# EAGLE design 3_Phase_Controller_V0.3 (EAGLE 9.6.2)
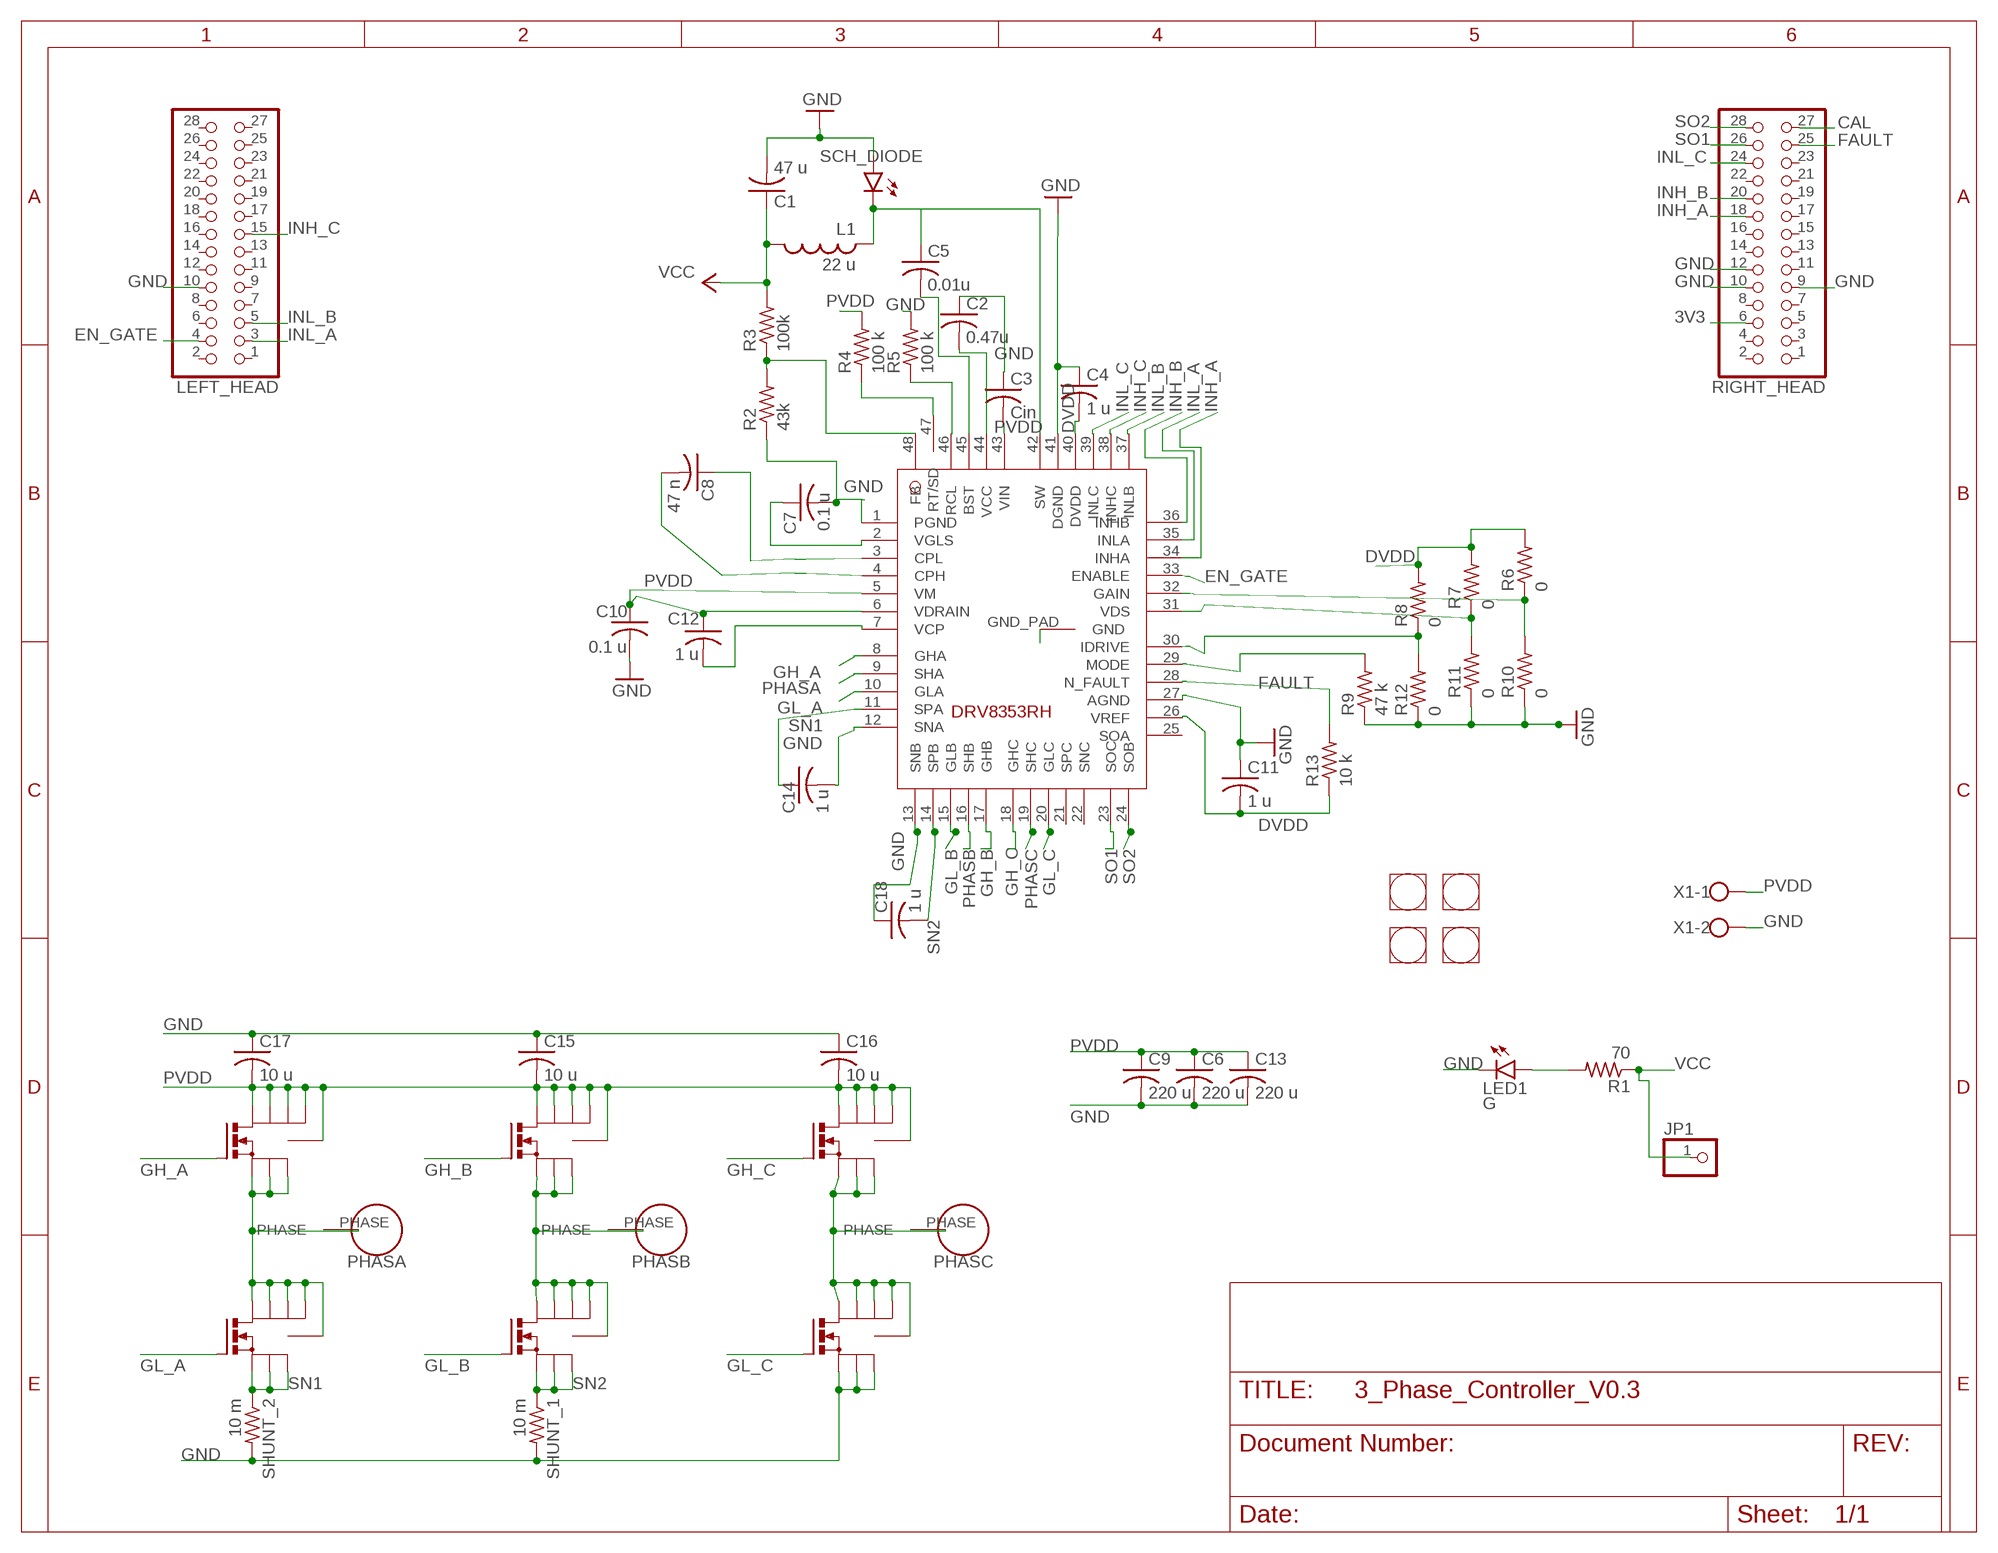
[diagram p0: schematic, sheet 1]

## Parts
A_H  SIR178DP  [POWERPAK_SO-8_SINGLE]
A_L  SIR178DP  [POWERPAK_SO-8_SINGLE]
B_H  SIR178DP  [POWERPAK_SO-8_SINGLE]
B_L  SIR178DP  [POWERPAK_SO-8_SINGLE]
C1  47 u  C-US025-024X044  [C025-024X044]
C2  0.47u  C-USC0805  [C0805]
C3  Cin  C-USC0805  [C0805]
C4  1 u  C-USC0805  [C0805]
C5  0.01u  C-USC0805  [C0805]
C6  220 u  C-US050-045X075  [C050-045X075]
C7  0.1 u  C-USC0805  [C0805]
C8  47 n  C-USC0805  [C0805]
C9  220 u  C-US050-045X075  [C050-045X075]
C10  0.1 u  C-USC0805  [C0805]
C11  1 u  C-USC0805  [C0805]
C12  1 u  C-USC0805  [C0805]
C13  220 u  C-US050-045X075  [C050-045X075]
C14  1 u  C-USC0805  [C0805]
C15  10 u  C-USC1206  [C1206]
C16  10 u  C-USC1206  [C1206]
C17  10 u  C-USC1206  [C1206]
C18  1 u  C-USC0805  [C0805]
C_H  SIR178DP  [POWERPAK_SO-8_SINGLE]
C_L  SIR178DP  [POWERPAK_SO-8_SINGLE]
JP1  PINHD-1X1  [1X01]
L1  22 u  L-USL3225M  [L3225M]
LED1  G  LEDSML0805  [SML0805]
LEFT_HEAD  PINHD-2X14  [2X14]
PHASE_A  PHASE_HOLE_V_0.2  [HOLE_V_0.2]
PHASE_B  PHASE_HOLE_V_0.2  [HOLE_V_0.2]
PHASE_C  PHASE_HOLE_V_0.2  [HOLE_V_0.2]
R1  70  R-US_R0805  [R0805]
R2  43k  R-US_R0603  [R0603]
R3  100k  R-US_R0603  [R0603]
R4  100 k  R-US_R0805  [R0805]
R5  100 k  R-US_R0805  [R0805]
R6  0  R-US_R0603  [R0603]
R7  0  R-US_R0603  [R0603]
R8  0  R-US_R0603  [R0603]
R9  47 k  R-US_R0603  [R0603]
R10  0  R-US_R0603  [R0603]
R11  0  R-US_R0603  [R0603]
R12  0  R-US_R0603  [R0603]
R13  10 k  R-US_R0603  [R0603]
RIGHT_HEAD  PINHD-2X14  [2X14]
SCH_DIODE  LEDCHIP-LED0805  [CHIP-LED0805]
SHUNT_1  10 m  R-US_R2512  [R2512]
SHUNT_2  10 m  R-US_R2512  [R2512]
U$1  STANDOFF  [STANDOFF]
U$2  STANDOFF  [STANDOFF]
U$3  DRV8353RH  [VQFN-RGZ0048A]
U$4  STANDOFF  [STANDOFF]
U$5  STANDOFF  [STANDOFF]
X1  W237-102  [W237-102]

## Nets
3V3: RIGHT_HEAD.6
CAL: RIGHT_HEAD.27
DVDD: C4.2 C11.2 R6.2 R7.2 R8.2 R13.1 U$3.26(VREF) U$3.40(DVDD)
EN_GATE: LEFT_HEAD.4 U$3.33(ENABLE)
FAULT: R13.2 RIGHT_HEAD.25 U$3.28(N_FAULT)
GH_A: A_H.GATE(G) U$3.8(GHA)
GH_B: B_H.GATE(G) U$3.17(GHB)
GH_C: C_H.GATE(G) U$3.18(GHC)
GL_A: A_L.GATE(G) U$3.10(GLA)
GL_B: B_L.GATE(G) U$3.15(GLB)
GL_C: C_L.GATE(G) U$3.20(GLC)
GND: C1.2 C2.1 C3.1 C4.1 C6.2 C7.2 C9.2 C10.2 C11.1 C13.2 C14.2 C15.1 C16.1 C17.1 C18.1 C_L.S_1(S) C_L.S_2(S1) C_L.S_3(S2) LED1.C LEFT_HEAD.10 R2.1 R5.2 R9.1 R10.1 R11.1 R12.1 RIGHT_HEAD.9 RIGHT_HEAD.10 RIGHT_HEAD.12 SCH_DIODE.A SHUNT_1.2 SHUNT_2.2 U$3.1(PGND) U$3.12(SNA) U$3.13(SNB) U$3.27(AGND) U$3.41(DGND) U$3.GND_PAD(GND) X1.2
INH_A: RIGHT_HEAD.18 U$3.34(INHA)
INH_B: RIGHT_HEAD.20 U$3.36(INHB)
INH_C: LEFT_HEAD.15 U$3.38(INHC)
INL_A: LEFT_HEAD.3 U$3.35(INLA)
INL_B: LEFT_HEAD.5 U$3.37(INLB)
INL_C: RIGHT_HEAD.24 U$3.39(INLC)
N$1: LED1.A R1.2
N$2: R6.1 R10.2 U$3.32(GAIN)
N$4: R2.2 R3.1 U$3.48(FB)
N$5: R7.1 R11.2 U$3.31(VDS)
N$6: C5.2 U$3.45(BST)
N$7: R8.1 R12.2 U$3.30(IDRIVE)
N$8: R9.2 U$3.29(MODE)
N$9: C2.2 U$3.44(VCC)
N$12: C12.2 U$3.7(VCP)
N$13: C7.1 U$3.2(VGLS)
N$14: R5.1 U$3.46(RCL)
N$15: R4.1 U$3.47(RT/SD)
N$21: C5.1 L1.2 SCH_DIODE.C U$3.42(SW)
N$22: C8.2 U$3.4(CPH)
N$23: C8.1 U$3.3(CPL)
PHASA: A_H.S_1(S) A_H.S_2(S1) A_H.S_3(S2) A_L.D_1(D) A_L.D_2(D1) A_L.D_3(D2) A_L.D_4(D3) A_L.THRM(THERMAL) PHASE_A.PHASE U$3.9(SHA)
PHASB: B_H.S_1(S) B_H.S_2(S1) B_H.S_3(S2) B_L.D_1(D) B_L.D_2(D1) B_L.D_3(D2) B_L.D_4(D3) B_L.THRM(THERMAL) PHASE_B.PHASE U$3.16(SHB)
PHASC: C_H.S_1(S) C_H.S_2(S1) C_H.S_3(S2) C_L.D_1(D) C_L.D_2(D1) C_L.D_3(D2) C_L.D_4(D3) C_L.THRM(THERMAL) PHASE_C.PHASE U$3.19(SHC)
PVDD: A_H.D_1(D) A_H.D_2(D1) A_H.D_3(D2) A_H.D_4(D3) A_H.THRM(THERMAL) B_H.D_1(D) B_H.D_2(D1) B_H.D_3(D2) B_H.D_4(D3) B_H.THRM(THERMAL) C3.2 C6.1 C9.1 C10.1 C12.1 C13.1 C15.2 C16.2 C17.2 C_H.D_1(D) C_H.D_2(D1) C_H.D_3(D2) C_H.D_4(D3) C_H.THRM(THERMAL) R4.2 U$3.5(VM) U$3.6(VDRAIN) U$3.43(VIN) X1.1
SN1: A_L.S_1(S) A_L.S_2(S1) A_L.S_3(S2) C14.1 SHUNT_2.1 U$3.11(SPA)
SN2: B_L.S_1(S) B_L.S_2(S1) B_L.S_3(S2) C18.2 SHUNT_1.1 U$3.14(SPB)
SO1: RIGHT_HEAD.26 U$3.23(SOC)
SO2: RIGHT_HEAD.28 U$3.24(SOB)
VCC: C1.1 JP1.1 L1.1 R1.1 R3.2
Unconnected: LEFT_HEAD.1 LEFT_HEAD.2 LEFT_HEAD.6 LEFT_HEAD.7 LEFT_HEAD.8 LEFT_HEAD.9 LEFT_HEAD.11 LEFT_HEAD.12 LEFT_HEAD.13 LEFT_HEAD.14 LEFT_HEAD.16 LEFT_HEAD.17 LEFT_HEAD.18 LEFT_HEAD.19 LEFT_HEAD.20 LEFT_HEAD.21 LEFT_HEAD.22 LEFT_HEAD.23 LEFT_HEAD.24 LEFT_HEAD.25 LEFT_HEAD.26 LEFT_HEAD.27 LEFT_HEAD.28 RIGHT_HEAD.1 RIGHT_HEAD.2 RIGHT_HEAD.3 RIGHT_HEAD.4 RIGHT_HEAD.5 RIGHT_HEAD.7 RIGHT_HEAD.8 RIGHT_HEAD.11 RIGHT_HEAD.13 RIGHT_HEAD.14 RIGHT_HEAD.15 RIGHT_HEAD.16 RIGHT_HEAD.17 RIGHT_HEAD.19 RIGHT_HEAD.21 RIGHT_HEAD.22 RIGHT_HEAD.23 U$3.21(SPC) U$3.22(SNC) U$3.25(SOA)

## Library data of the parts
A_H A_L B_H B_L C_H C_L = Brad_Library:SIR178DP
C1-C5 C7 C8 C10-C12 C14-C18 = rcl:C-US: CAPACITOR, American symbol; SPICEPREFIX: C
C6 C9 C13 = Brad_Library:C-US: CAPACITOR, American symbol; SPICEPREFIX: C
JP1 = pinhead:PINHD-1X1: PIN HEADER
L1 = rcl:L-US: INDUCTOR, American symbol; SPICEPREFIX: L
LED1 SCH_DIODE = led:LED: LED OSRAM: - CHIPLED LG R971, LG N971, LY N971, LG Q971, LY Q971, LO R971, LY R971 LH N974, LH R974 LS Q976, LO Q976, LY Q976 LO Q996 - Hyper CHIPLED LW Q18S LB Q993, LB Q99A, LB R99A - SideLED LS A670, LO A670, LY A670, LG A670, LP A670 LB A673, LV A673, LT A673, LW A673 LH A674 LY A675 LS A676, LA A676, LO A676, LY A676, LW A676 LS A679, LY A679, LG A679 - Hyper Micro SIDELED® LS Y876, LA Y876, LO Y876, LY Y876 LT Y87S - SmartLED LW L88C, LW L88S LB L89C, LB L89S, LG L890 LS L89K, LO L89K, LY L89K LS L896, LA L896, LO L896, LY L896 - TOPLED LS T670, LO T670, LY T670, LG T670, LP T670 LSG T670, LSP T670, LSY T670, LOP T670, LYG T670 LG T671, LOG T671, LSG T671 LB T673, LV T673, LT T673, LW T673 LH T674 LS T676, LA T676, LO T676, LY T676, LB T676, LH T676, LSB T676, LW T676 LB T67C, LV T67C, LT T67C, LS T67K, LO T67K, LY T67K, LW E67C LS E67B, LA E67B, LO E67B, LY E67B, LB E67C, LV E67C, LT E67C LW T67C LS T679, LY T679, LG T679 LS T770, LO T770, LY T770, LG T770, LP T770 LB T773, LV T773, LT T773, LW T773 LH T774 LS E675, LA E675, LY E675, LS T675 LS T776, LA T776, LO T776, LY T776, LB T776 LHGB T686 LT T68C, LB T68C - Hyper Mini TOPLED® LB M676 - Mini TOPLED Santana® LG M470 LS M47K, LO M47K, LY M47K Source: http://www.osram.convergy.de LUXEON: - LUMILED® LXK2-PW12-R00, LXK2-PW12-S00, LXK2-PW14-U00, LXK2-PW14-V00 LXK2-PM12-R00, LXK2-PM12-S00, LXK2-PM14-U00 LXK2-PE12-Q00, LXK2-PE12-R00, LXK2-PE12-S00, LXK2-PE14-T00, LXK2-PE14-U00 LXK2-PB12-K00, LXK2-PB12-L00, LXK2-PB12-M00, LXK2-PB14-N00, LXK2-PB14-P00, LXK2-PB14-Q00 LXK2-PR12-L00, LXK2-PR12-M00, LXK2-PR14-Q00, LXK2-PR14-R00 LXK2-PD12-Q00, LXK2-PD12-R00, LXK2-PD12-S00 LXK2-PH12-R00, LXK2-PH12-S00 LXK2-PL12-P00, LXK2-PL12-Q00, LXK2-PL12-R00 Source: www.luxeon.com KINGBRIGHT: KA-3528ASYC Source: www.kingbright.com
LEFT_HEAD RIGHT_HEAD = Brad_Library:PINHD-2X14: PIN HEADER
PHASE_A PHASE_B PHASE_C = Brad_Library:PHASE_HOLE_V_0.2
R1-R13 = rcl:R-US_: RESISTOR, American symbol; SPICEPREFIX: R
SHUNT_1 SHUNT_2 = Brad_Library:R-US_: RESISTOR, American symbol; SPICEPREFIX: R
U$1 U$2 U$4 U$5 = Brad_Library:STANDOFF
U$3 = Brad_Library:DRV8353RH
X1 = Brad_Library:W237-102: WAGO SCREW CLAMP; MPN: 237-102; OC_FARNELL: unknown; OC_NEWARK: 70K9898

## Board
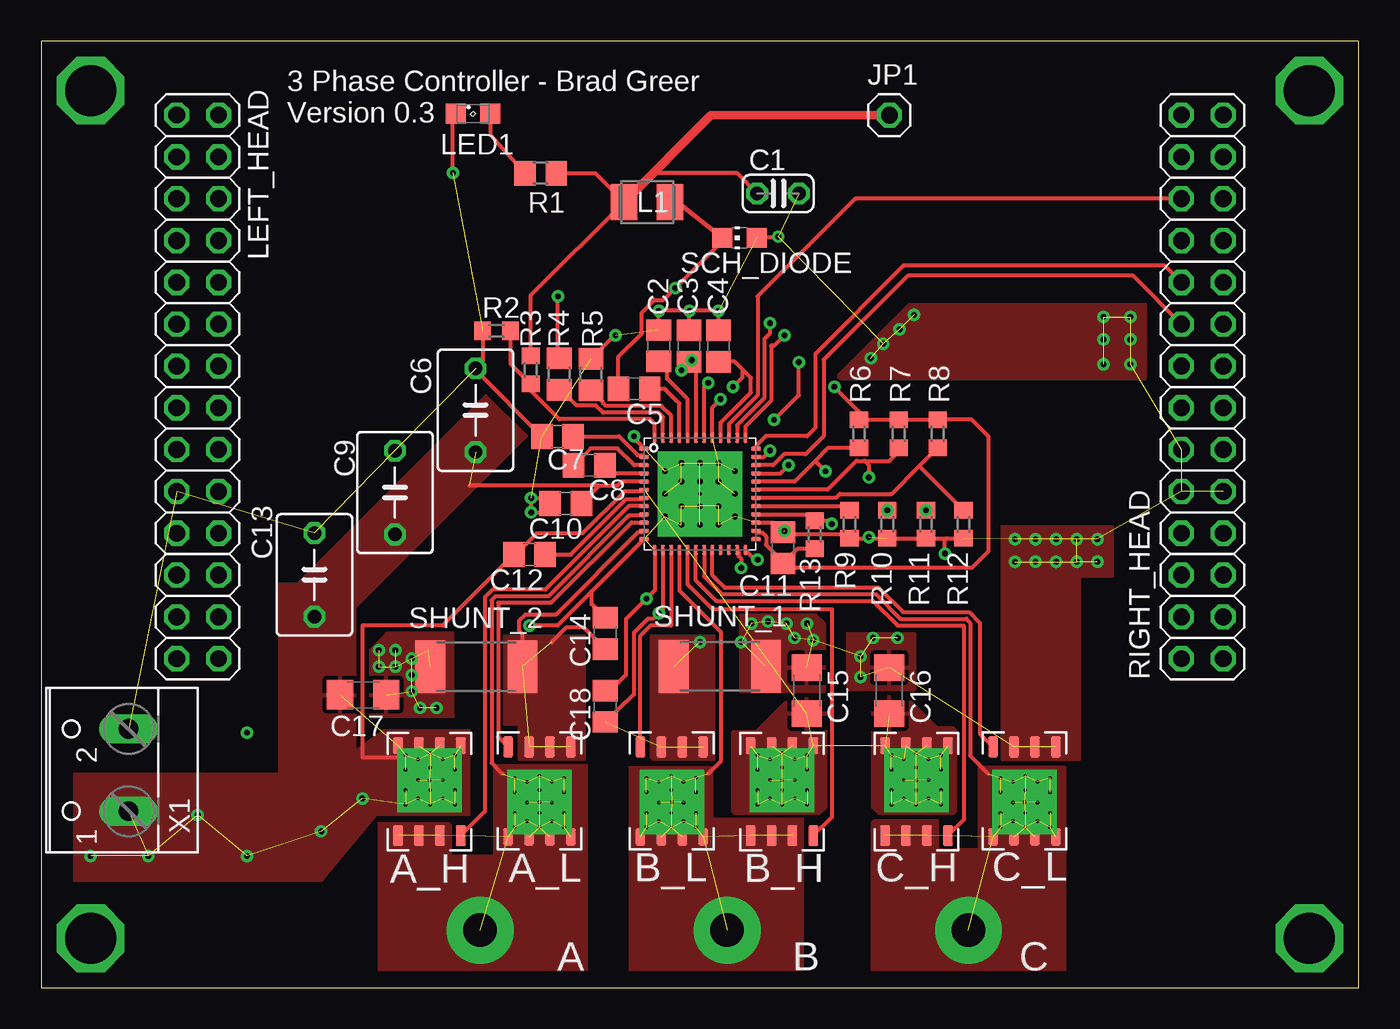
[diagram p1: board, top side]
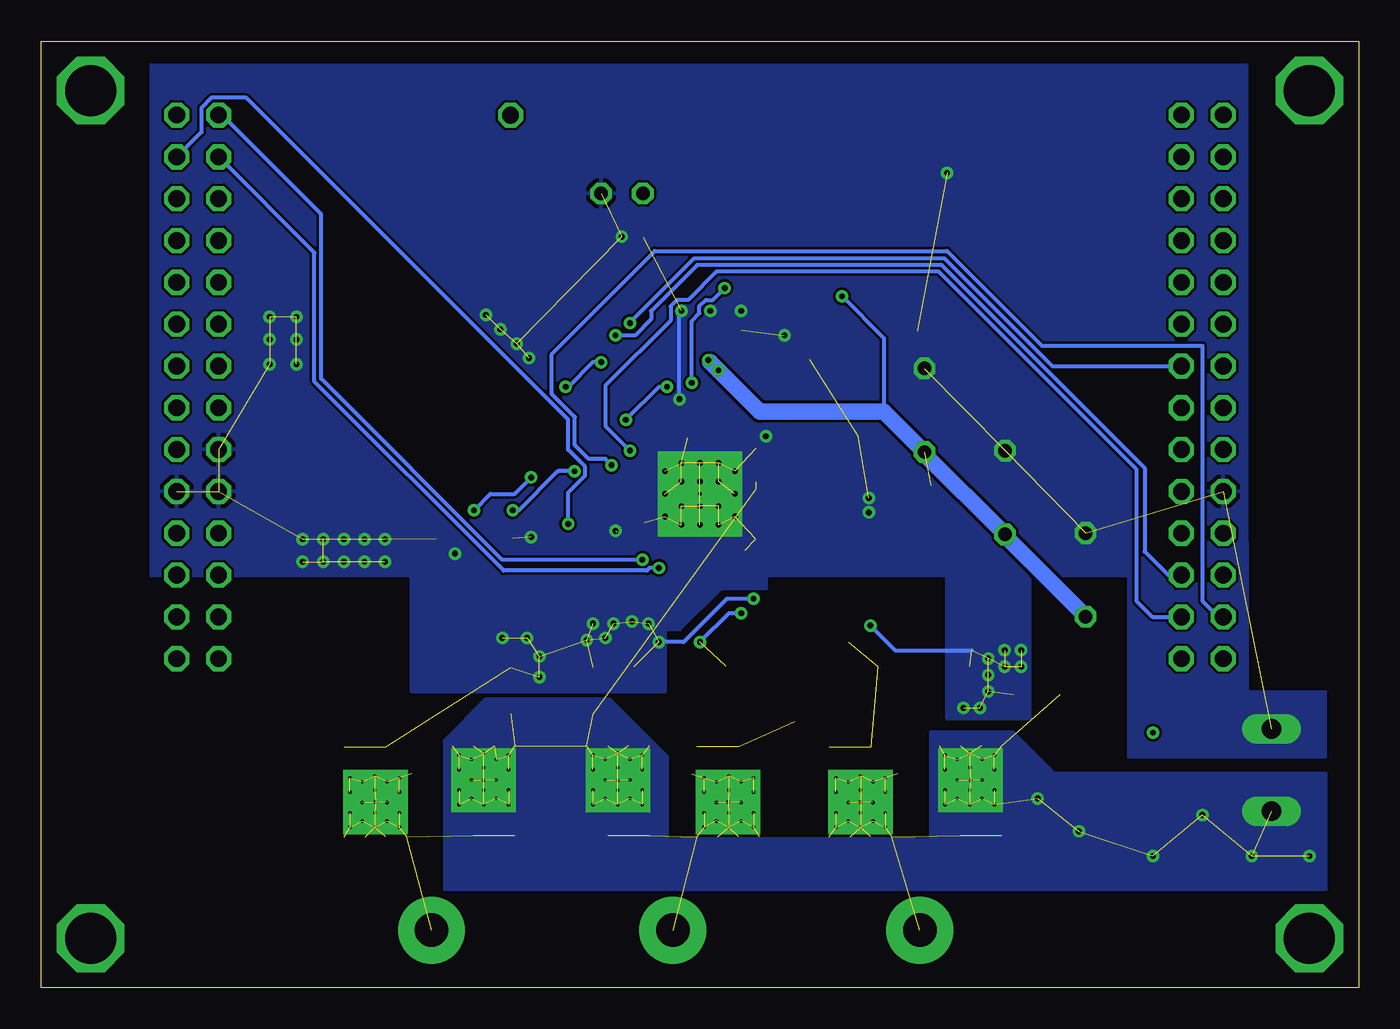
[diagram p2: board, bottom side, seen from below]

Size 80 x 57.5 mm. Coordinates in mm from the lower left corner, seen from the top.
Outline: 0,0 80,0 80,57.5 0,57.5 0,0
Copper layers (1*16): Top 0.035mm / dielectric 1.5mm / Bottom 0.035mm
Design rules "default": minimum track width 6mil, minimum drill 0.35mm, track to track 6mil, track to pad 6mil, pad to pad 6mil, via to via 6mil, smd to smd 6mil, copper to edge 40mil, drill to drill 6mil, minimum pad ring 10mil, minimum via ring 8mil, stop-mask expansion 4mil, vias tented up to drill 0mil, thermal gap 10mil

### Footprints (pad centres in the part's own frame; a part is rotated, then mirrored left to right if it is on the bottom)
POWERPAK_SO-8_SINGLE = smd 1.016 x 0.61: D_1 6.096,-1.905; D_2 6.096,-0.635; D_3 6.096,0.635; D_4 6.096,1.905 | smd 1.27 x 0.61: GATE 0.635,-1.905; S_1 0.635,1.905; S_2 0.635,0.635; S_3 0.635,-0.635 | drill 0.203 pad 3.912 square: THRM 3.988,0
C025-024X044 = drill 0.813 octagon: 1 -1.27,0; 2 1.27,0
C0805 = smd 1.3 x 1.5: 1 -0.95,0; 2 0.95,0
C050-045X075 = drill 0.813 octagon: 1 -2.54,0; 2 2.54,0
C1206 = smd 1.6 x 1.8: 1 -1.4,0; 2 1.4,0
1X01 = drill 1.016 octagon: 1 0,0
L3225M = smd 1.6 x 2.2: 1 -1.4,0; 2 1.4,0
SML0805 = smd 1.2 x 1.2: A 1.05,0; C -1.05,0
2X14 = drill 1.016 octagon: 1 -16.51,-1.27; 2 -16.51,1.27; 3 -13.97,-1.27; 4 -13.97,1.27; 5 -11.43,-1.27; 6 -11.43,1.27; 7 -8.89,-1.27; 8 -8.89,1.27; 9 -6.35,-1.27; 10 -6.35,1.27; 11 -3.81,-1.27; 12 -3.81,1.27; 13 -1.27,-1.27; 14 -1.27,1.27; 15 1.27,-1.27; 16 1.27,1.27; 17 3.81,-1.27; 18 3.81,1.27; 19 6.35,-1.27; 20 6.35,1.27; 21 8.89,-1.27; 22 8.89,1.27; 23 11.43,-1.27; 24 11.43,1.27; 25 13.97,-1.27; 26 13.97,1.27; 27 16.51,-1.27; 28 16.51,1.27
HOLE_V_0.2 = drill 2.032 pad 4.064: PHASE 0,0
R0805 = smd 1.3 x 1.5: 1 -0.95,0; 2 0.95,0
R0603 = smd 1 x 1.1: 1 -0.85,0; 2 0.85,0
CHIP-LED0805 = smd 1.2 x 1.2: A 0,-1.05; C 0,1.05
R2512 = smd 1.8 x 3.2: 1 -2.8,0; 2 2.8,0
STANDOFF = drill 3.1 octagon: P$1 0,0
VQFN-RGZ0048A = smd 0.6 x 0.24: 1 -3.4,2.75; 2 -3.4,2.25; 3 -3.4,1.75; 4 -3.4,1.25; 5 -3.4,0.75; 6 -3.4,0.25; 7 -3.4,-0.25; 8 -3.4,-0.75; 9 -3.4,-1.25; 10 -3.4,-1.75; 11 -3.4,-2.25; 12 -3.4,-2.75; 25 3.4,-2.75; 26 3.4,-2.25; 27 3.4,-1.75; 28 3.4,-1.25; 29 3.4,-0.75; 30 3.4,-0.25; 31 3.4,0.25; 32 3.4,0.75; 33 3.4,1.25; 34 3.4,1.75; 35 3.4,2.25; 36 3.4,2.75 | smd 0.24 x 0.6: 13 -2.75,-3.4; 14 -2.25,-3.4; 15 -1.75,-3.4; 16 -1.25,-3.4; 17 -0.75,-3.4; 18 -0.25,-3.4; 19 0.25,-3.4; 20 0.75,-3.4; 21 1.25,-3.4; 22 1.75,-3.4; 23 2.25,-3.4; 24 2.75,-3.4; 37 2.75,3.4; 38 2.25,3.4; 39 1.75,3.4; 40 1.25,3.4; 41 0.75,3.4; 42 0.25,3.4; 43 -0.25,3.4; 44 -0.75,3.4; 45 -1.25,3.4; 46 -1.75,3.4; 47 -2.25,3.4; 48 -2.75,3.4 | drill 0.2 pad 5.15 square: GND_PAD 0,0
W237-102 = drill 1.194 long: 1 -2.5,-1.27; 2 2.5,-1.27

### Placement (x,y rotation side)
A_H  23.57,8.61 90 top
A_L  30.26,15.27 270 top
B_H  44.98,8.61 90 top
B_L  38.29,15.27 270 top
C1  44.74,48.25 0 top
C2  37.5,39 270 top
C3  39.34,38.98 270 top
C4  41.12,38.98 270 top
C5  36,36.38 0 top
C6  26.37,35.08 90 top
C7  31.35,33.48 180 top
C8  33.27,31.74 0 top
C9  21.48,30.08 90 top
C10  31.85,29.41 180 top
C11  45.05,26.73 270 top
C12  29.65,26.32 0 top
C13  16.59,25.08 90 top
C14  34.25,21.52 90 top
C15  46.48,18.05 270 top
C16  51.49,18.05 270 top
C17  19.55,17.8 180 top
C18  34.25,17.1 270 top
C_H  53.14,8.61 90 top
C_L  59.7,15.27 270 top
JP1  51.5,53 0 top
L1  36.79,47.72 0 top
LED1  26.22,53.09 0 top
LEFT_HEAD  9.5,36.5 90 top
PHASE_A  26.65,3.5 0 top
PHASE_B  41.65,3.5 0 top
PHASE_C  56.3,3.5 0 top
R1  30.32,49.47 180 top
R2  27.65,39.9 0 top
R3  29.73,37.52 90 top
R4  31.46,37.27 90 top
R5  33.38,37.25 90 top
R6  49.65,33.65 90 top
R7  52.07,33.65 90 top
R8  54.43,33.65 90 top
R9  49.08,28.15 90 top
R10  51.37,28.15 90 top
R11  53.72,28.15 90 top
R12  56,28.15 90 top
R13  46.97,27.52 90 top
RIGHT_HEAD  70.5,36.5 90 top
SCH_DIODE  42.4,45.55 90 top
SHUNT_1  41.2,19.52 0 top
SHUNT_2  26.42,19.51 180 top
U$1  3,54.5 0 top
U$2  77,54.5 0 top
U$3  40,30 0 top
U$4  3,3 0 top
U$5  77,3 0 top
X1  4.04,13.22 90 top

### Tracks (layer width: path | path; a pad name or v marks a point on that pad's centre or on a via)
DVDD  (via drill 0.35)
  Top 0.254: C11.2 45.05,25.88 44.02,26.91 44.02,27.41 43.78,27.65 43.5,27.65 U$3.26 | C11.2 45.95,26.68 R13.1 | C11.2 45.32,25.5 56.5,25.5 57.5,26.5 57.5,33.5 56.5,34.5 R8.2 R7.2 R6.2 49.65,35.01 v48.16,36.5 | U$3.40 41.25,34.33 43.09,36.16 43.09,37.06 42.58,37.58 | 42.58,37.58 42.12,38.02 C4.2 | 42.58,37.58 42.58,37.08 v42,36.5 | v44.5,34.5 46,36 v46,38
  Bottom 0.254: v42,36.5 42.5,36.5 v44.5,34.5 | v46,38 46.5,38 48,36.5 v48.16,36.5
EN_GATE  (via drill 0.35)
  Top 0.254: v45.38,31.75 44.88,31.25 U$3.33
  Bottom 0.254: v45.38,31.75 45.75,32.12 46.75,32.12 47.59,32.97 47.59,34.67 49,36.08 49,38.5 42.75,44.75 25,44.75 19.25,39 9.5,39 9.5,23.5 8.53,22.53 LEFT_HEAD.4
FAULT  (via drill 0.35)
  Top 0.254: v48,28.18 47.8,28.38 R13.2 46.59,28.75 U$3.28
  Bottom 0.254: v48,28.18 48,30.07 46.97,31.1 46.97,31.65 48,32.68 48,34.5 67.55,54.05 69.66,54.05 70.27,53.44 70.27,51.97 RIGHT_HEAD.25
GH_A
  Top 0.254: A_H.GATE 26.94,10.71 26.94,23.71 27.41,24.19 30.61,24.19 35.7,29.28 36.57,29.28 U$3.8
GH_B
  Top 0.254: B_H.GATE 48,10.36 48,23 40.75,23 39.38,24.38 39.25,24.5 U$3.17
GH_C
  Top 0.254: C_H.GATE 56,10.2 56,22 52,22 50.5,23.5 41,23.5 40,24.5 39.75,24.75 U$3.18
GL_A
  Top 0.254: A_L.GATE 27.75,15.23 27.75,23.38 30.95,23.38 35.84,28.27 36.58,28.27 U$3.10
GL_B
  Top 0.254: B_L.GATE 36.38,21.38 37,22 38.25,22 U$3.15
GL_C
  Top 0.254: C_L.GATE 57,15.43 57,22.15 56.34,22.81 52.34,22.81 50.84,24.31 41.5,24.31 40.91,24.91 40.75,25.06 U$3.20
GND  (via drill 0.35)  (85 unrouted)
  Top 0.254: 33.42,24.07 31.35,22 v29.66,22 29.5,22 | v44.75,45.62 44.67,45.55 SCH_DIODE.A | v25,49.5 25,52.92 LED1.C | 55,27.3 R11.1 R10.1 R9.1 48.78,27.52 45.12,27.52 C11.1 44.47,28.25 U$3.27 | 55,27.3 R12.1 | C18.1 34.55,18.05 35.5,19 35.5,22.38 v36.75,23.62 37.25,24.12 U$3.13 | C14.2 33.42,23.3 33.42,24.07 | v54.88,26.38 54.88,27.18 55,27.3 | U$3.12 33.42,24.07 | C2.1 v37.5,41.12 v39.38,41.12 | C3.1 39.34,41.09 v39.38,41.12 | C4.1 v41.12,41.12 v39.38,41.12 | v34.88,39.62 34.8,39.62 R5.2 | R2.1 26.8,38.05 C6.2 | C6.2 | C7.2 26.38,37.51 C6.2 | U$3.41 40.75,35.26 v41.25,35.75 | U$3.1 36,33.35 v36,33.5 | v29.75,29.75 30.56,29.75 C10.2 30.37,28.88 v29.75,28.88 v29.75,29.75
  Bottom 0.254: v29.66,22 28.16,20.5 23.5,20.5 | v36.75,23.62 38.38,23.62 41,21 v42.5,21 | v41.25,35.75 41.25,41 v41.12,41.12
  other vias: 49.75,18.88 49.75,20.12 50.5,21.25 52,21.25 20.5,20.5 21.5,20.5 21.5,19.5 20.5,19.5 23,17 24,17 43.12,22.12 44.12,22.25 45.25,22.12 46.5,22.12 45.75,21.25 46.88,21.12 59.12,27.25 60.38,27.25 61.62,27.25 59.12,25.88 60.38,25.88 61.62,25.88 45.12,27.75 50.25,27.38 37.88,31.38 38.88,31.88 40,31.88 41.12,31.88 42.12,31.38 41.12,30.75 40,30.75 38.88,30.75 37.88,30 37.88,28.62 38.88,29.25 40,29.25 41.12,29.25 42.12,30 42.12,28.62 41.12,28.12 40,28.12 38.88,28.12 22.5,20 22.5,19 22.5,18 62.88,27.25 62.88,25.88 64.12,27.25 64.12,25.88 53,40.88 66.12,37.88 64.5,37.88 64.5,39.38 66.12,39.38 66.12,40.75 64.5,40.75 52.12,40 51.12,39.12 50.38,38.25
  pour Bottom: 73.35,25 73.35,56.07 6.77,56.07 6.77,25
  pour Bottom: 6.75,27 6.75,14 14,14 14,27
  pour Bottom: 20,25.5 20,16.38 25,16.38 25,25.5
  pour Top: 25,16.5 25,21.5 21,21.5 20,20.5 20,16.5
  pour Top: 42.5,22.62 47,22.62 47.5,22.12 47.5,18 42.5,18
  pour Bottom: 42.12,26 42.12,18 57.5,18 57.5,26
  pour Top: 49,21.5 53,21.5 53,18.12 49,18.12
  pour Top: 58.38,13.88 58.38,28 63,28 63,13.88
  pour Bottom: 9,18 2,18 2,14 9,14
  pour Top: 58.5,28 65,28 65,25 58.5,25
  pour Bottom: 36,25 36,24.25 38.5,24.25 38.75,24.25 41.25,21.75 42.75,21.75 42.75,24.62 42.12,24.62 41.75,25
  pour Top: 48.25,37 52.75,41.5 67,41.5 67,37
  pour Bottom: 31.38,28.5 31.38,30.5 29,30.5 29,28.38 31.25,28.38
INH_A
  Top 0.254: RIGHT_HEAD.18 66.29,43.25 52.6,43.25 47.5,38.15 47.5,33.5 46.41,32.41 45.1,32.41 44.45,31.75 U$3.34
INH_B
  Top 0.254: RIGHT_HEAD.20 68.23,43.85 52.35,43.85 47,38.5 47,34 46.5,33.5 44,33.5 43.4,32.9 U$3.36
INH_C  (via drill 0.35)
  Top 0.254: v44.25,40.38 44.25,39.75 43.91,39.41 43.91,35.83 42.25,34.17 U$3.38
  Bottom 0.254: LEFT_HEAD.15 18.62,37.77 25.16,44.31 40.34,44.31 44.25,40.4 v44.25,40.38
INL_A  (via drill 0.35)
  Top 0.254: U$3.35 43.88,32.25 v44.25,32.62
  Bottom 0.254: LEFT_HEAD.3 12.53,22.53 13.5,23.5 13.5,31.5 25.5,43.5 39,43.5 40.72,41.78 41.4,41.78 41.78,41.4 41.78,40.54 45.75,36.57 45.75,34.12 v44.25,32.62
INL_B  (via drill 0.35)
  Top 0.254: v45.12,39.62 44.5,39 44.31,39 44.31,35.66 42.75,34.1 U$3.37
  Bottom 0.254: LEFT_HEAD.5 11.57,25.07 13,26.5 13,31.57 25.33,43.91 40.17,43.91 42.97,41.11 42.97,40.6 43.95,39.62 v45.12,39.62
INL_C
  Top 0.254: RIGHT_HEAD.24 49.43,47.93 43.5,42 43.5,36 41.75,34.25 U$3.39
N$1
  Top 0.254: LED1.A 27.27,51.83 R1.2
N$2  (via drill 0.35)
  Top 0.254: R6.1 47.8,32.8 47,32 | 47,32 46,31 45.75,30.75 U$3.32 | 47,32 v47.62,31.38
  Bottom 0.254: v47.62,31.38 48.62,31.38 51,29 R10.2
  other vias: 51.37,29
N$3  (via drill 0.35)
  other vias: 12.5,15.5
N$4
  Top 0.254: U$3.48 37.25,34.25 36.97,34.53 31.46,34.53 29.73,36.27 R3.1 28.5,37.9 R2.2
N$5  (via drill 0.35)
  Top 0.254: 50,32 49.5,32 47.75,30.25 U$3.31 | 50,32 51.5,32 52.07,32.57 R7.1 | 50,32 50.25,31.75 v50.25,31
  Bottom 0.254: v50.25,31 51.25,30 52.72,30 R11.2
  other vias: 53.72,29
N$6
  Top 0.254: U$3.45 38.75,35.5 37.88,36.38 C5.2
N$7
  Top 0.254: 53.31,31.68 51.63,30 48.5,30 48.25,29.75 U$3.30 | 53.31,31.68 R8.1 | R12.2 53.31,31.68
N$8
  Top 0.254: U$3.29 48.83,29.25 R9.2
N$9
  Top 0.254: C2.2 38,37.55 38,37 39.25,35.75 U$3.44
N$12
  Top 0.254: C12.2 32.16,26.32 35.53,29.69 36.54,29.69 U$3.7
N$13
  Top 0.254: U$3.2 36.5,32.35 36.22,32.35 35.09,33.48 C7.1
N$14
  Top 0.254: U$3.46 38.25,34.75 37.65,35.35 34.28,35.35 34.12,35.51 34.12,35.55 R5.1
N$15
  Top 0.254: U$3.47 37.75,34.67 37.49,34.94 34.12,34.94 33.69,35.37 32.51,35.37 31.55,36.33 R4.1
N$21  (via drill 0.35)
  Top 0.254: SCH_DIODE.C 41.45,45.45 | 41.45,45.45 41.52,45.38 | U$3.42 40.25,36.5 v40.5,36.75 | 41.45,45.45 v38.5,42.5 37.78,41.78 37.23,41.78 36.47,41.03 36.47,39.75 35.05,38.33 C5.1
  Top 0.305: L1.2 38.71,47.67 SCH_DIODE.C
  Bottom 0.254: v40.5,36.75 40.5,40.5 40.03,40.97 40.03,41.4 39.65,41.78 39.22,41.78 v38.5,42.5
N$22
  Top 0.254: U$3.4 34.72,31.25 C8.2
N$23
  Top 0.203: 33.35,32.77 C8.1
  Top 0.254: U$3.3 36.01,31.75 34.99,32.77 33.35,32.77
PHASA  (via drill 0.2)  (27 unrouted)
  Top 0.254: U$3.9 36.53,28.68 35.68,28.68 30.78,23.78 27.58,23.78 27.34,23.54 27.34,13.66 28,13
  other vias: 28.75,12.75 30.25,12.88 31.75,12.75 29.5,12.5 31,12.5 30.25,12 28.75,11.88 29.5,11.25 31,11.25 31.75,11.88 31.75,10.62 30.25,10.62 28.75,10.62 28.75,9.75 29.5,10.12 30.25,9.75 31,10.12 31.75,9.75
  pour Top: 24.75,10 20.5,10 20.5,0.5 33.12,0.5 33.12,13.5 27.5,13.5 27.5,8 24.88,8 24.88,9.88
PHASB  (via drill 0.2)  (27 unrouted)
  Top 0.254: U$3.16 38.75,24.12 41.25,21.62 41.25,13.75 40.5,13
  other vias: 36.75,12.75 38.25,12.88 39.75,12.75 37.5,12.5 39,12.5 38.25,12 36.75,11.88 37.5,11.25 39,11.25 39.75,11.88 39.75,10.62 38.25,10.62 36.75,10.62 36.75,9.75 37.5,10.12 38.25,9.75 39,10.12 39.75,9.75
  pour Top: 35.75,13.38 35.75,0.5 46.25,0.5 46.25,10.25 40.75,10.25 40.75,13.38
PHASC  (via drill 0.2)  (27 unrouted)
  Top 0.254: 57.5,13 56.41,14.09 56.41,22.17 56.17,22.41 52.17,22.41 50.67,23.91 41.33,23.91 40.25,24.99 U$3.19
  other vias: 58.25,12.75 59.75,12.88 61.25,12.75 59,12.5 60.5,12.5 59.75,12 58.25,11.88 59,11.25 60.5,11.25 61.25,11.88 61.25,10.62 59.75,10.62 58.25,10.62 58.25,9.75 59,10.12 59.75,9.75 60.5,10.12 61.25,9.75
  pour Top: 50.62,10.12 54.38,10.12 54.38,8.38 57,8.38 57,13.38 62.12,13.38 62.12,0.5 50.5,0.5 50.5,10
PVDD  (via drill 0.2, 0.35)  (80 unrouted)
  Top 0.254: U$3.6 36.51,30.16 35.43,30.16 32.87,27.59 30.08,27.59 29.01,26.52 28.9,26.52 C12.1 24.38,22 19.5,22 19.5,14 22,14 v22.12,14.12 | U$3.5 35.25,30.75 35,30.5 33.89,30.5 | 33.89,30.5 26,30.5 | C10.1 33.89,30.5 | U$3.43 39.75,37.5 39.34,37.91 C3.2 | R4.2 31.38,38.31 v31.38,42 | C3.2 39.34,37.96 v38.88,37.5 | C3.2 39.44,38.12 v39.5,38.12
  Bottom 0.254: v31.38,42 28.83,39.45 28.83,35
  Bottom 1.016: C13.1 21.48,27.43 C9.1 26.37,32.43 C6.1 28.83,35 36.38,35 v38.88,37.5 39.38,38
  other vias: 22.88,13.88 23.62,14.25 24.38,13.88 25.12,14.12 25.12,13.25 23.62,13.38 22.12,13.25 22.88,12.62 24.38,12.62 25.12,12 23.62,12 22.12,12 22.88,11.5 22.12,11.12 23.62,11.12 24.38,11.5 25.12,11.12 43.5,14.12 45,14.25 46.5,14.12 44.25,13.88 45.75,13.88 45,13.38 43.5,13.25 44.25,12.62 45.75,12.62 46.5,13.25 46.5,12 45,12 43.5,12 43.5,11.12 44.25,11.5 45,11.12 45.75,11.5 46.5,11.12 51.62,14.12 53.12,14.25 54.62,14.12 52.38,13.88 53.88,13.88 53.12,13.38 51.62,13.25 52.38,12.62 53.88,12.62 54.62,13.25 54.62,12 53.12,12 51.62,12 51.62,11.12 52.38,11.5 53.12,11.12 53.88,11.5 54.62,11.12 3,8 6.5,8 9.5,10.5 12.5,8 17,9.5 19.5,11.5
  pour Top: 2,13 17.21,13 20.8,15.62 26,15.62 26,10.5 20.33,10.5 17,6.5 2,6.5
  pour Top: 42,15.5 42,10.75 42.12,10.62 47.25,10.62 47.62,11 47.62,17.5 45.38,17.5 43.38,15.5
  pour Top: 50.5,17.62 50.5,11 50.88,10.62 55.38,10.62 55.5,10.75 55.5,15.62 55.38,15.75 54.38,15.75 52.5,17.62
  pour Bottom: 2,13 18.5,13 21,15.5 26,15.5 26,9 42,9 42,14 45.5,17.5 53,17.5 55.5,15 55.5,6 2,6
  pour Top: 14.5,12.5 14.5,24.5 19,24.5 19,12.5
  pour Top: 17.5,21.5 29.5,33.5 27,36 15.5,24.5 15.5,23.5
SN1  (4 unrouted)
  Top 0.254: C14.1 32.95,21.88 31.88,21.88 31,21 | U$3.11 36.51,27.66 36.23,27.66 31.23,22.66 29.38,22.66 29,22.27 29,21.73 29.22,21.51 SHUNT_2.1
  pour Top: 29,13.88 33,13.88 33,21.38 28.12,21.38 28.12,16 29,16
SN2  (via drill 0.35)  (4 unrouted)
  Top 0.254: C18.2 35.98,17.82 35.98,21.55 36.83,22.41 37.16,22.41 v37.5,22.75 37.75,23 U$3.14
  Bottom 0.254: v37.5,22.75 38.25,22.75 v40,21
  pour Top: 37.12,13.88 40.88,13.88 40.88,21.38 37,21.38 37,14
SO1  (via drill 0.35)
  Top 0.254: v42.5,25.5 42.5,26.07 42.35,26.22 42.35,26.5 U$3.23
  Bottom 0.254: v42.5,25.5 43.07,25.5 43.23,25.34 51.92,25.34 63.41,36.83 63.41,44.65 RIGHT_HEAD.26
SO2  (via drill 0.35)
  Top 0.254: U$3.24 43.35,26 v43.5,26
  Bottom 0.254: v43.5,26 52,26 63,37 63,47 69.01,53.01 RIGHT_HEAD.28
VCC
  Top 0.254: L1.1 37.16,49.5 42.22,49.5 C1.1 | R1.1 33.64,49.47 L1.1 | R3.2 29.73,42.06 L1.1
  Top 0.508: L1.1 40.66,53 JP1.1

### Text on the board
tPlace: 3 Phase Controller - Brad Greer / Version 0.3 | A | B | C